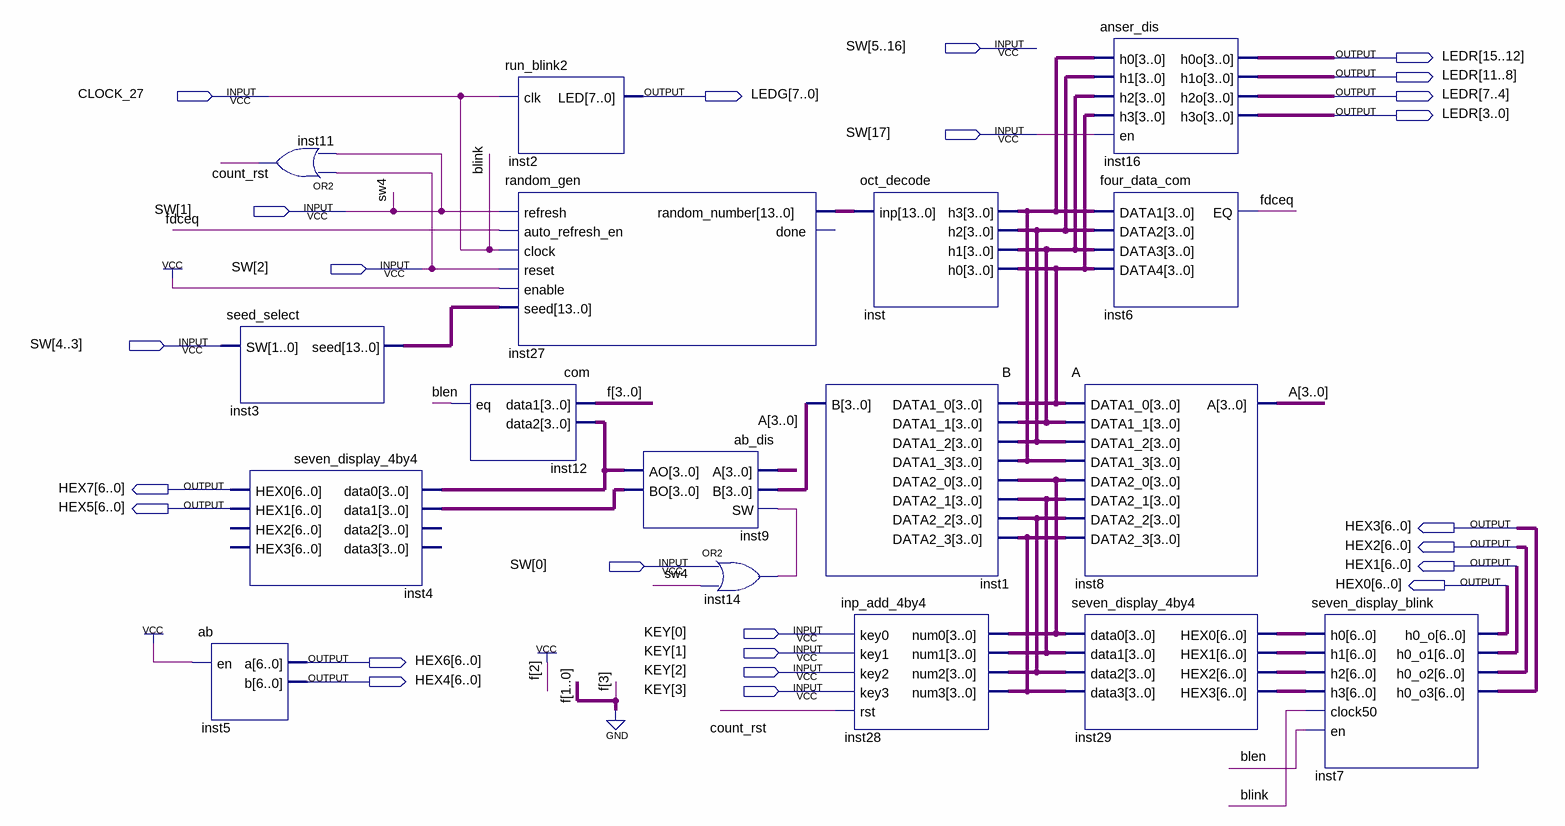
[diagram p0: schematic sheet]
// Quartus schematic FINAL.bdf as structural Verilog: 17 symbols, 24 pins
module FINAL (
  input  [0:17] SW,
  input  CLOCK_27,
  input  [3:0] KEY,
  output [15:0] LEDR,
  output [7:0] LEDG,
  output [6:0] HEX7,
  output [6:0] HEX5,
  output [6:0] HEX3,
  output [6:0] HEX2,
  output [6:0] HEX1,
  output [6:0] HEX0,
  output [6:0] HEX6,
  output [6:0] HEX4
);

  wire blen, count_rst, fdceq, inst14_out;
  wire [3:0] A, inst1_b, inst9_ao, inst9_bo, inst28_num0, inst28_num1, inst28_num2, inst28_num3, inst_h0,
       inst_h1, inst_h2, inst_h3;
  wire [3:3] f;
  wire [6:0] inst29_hex0, inst29_hex1, inst29_hex2, inst29_hex3;
  wire [13:0] inst3_seed, inst27_random_number;

  seed_select inst3 (.SW({SW[4], SW[3]}), .seed(inst3_seed));
  seven_display_4by4 inst4 (
    .data0(inst9_ao), .data1(inst9_bo), .HEX0(HEX7), .HEX1(HEX5));  // open: data2, data3, HEX2, HEX3
  ab inst5 (.en(1'b1), .a(HEX6), .b(HEX4));
  or inst11 (count_rst, SW[2], SW[1]);
  com inst12 (.data1({f[3], 3'b100}), .data2(inst9_ao), .eq(blen));
  run_blink2 inst2 (.clk(CLOCK_27), .LED(LEDG));
  random_gen inst27 (
    .refresh(SW[1]), .auto_refresh_en(fdceq), .clock(CLOCK_27), .reset(SW[2]), .enable(1'b1),
    .seed(inst3_seed), .random_number(inst27_random_number));  // open: done
  ab_dis inst9 (.A(A), .B(inst1_b), .SW(inst14_out), .AO(inst9_ao), .BO(inst9_bo));
  or inst14 (inst14_out, SW[0], SW[1]);
  oct_decode inst (.inp(inst27_random_number), .h3(inst_h3), .h2(inst_h2), .h1(inst_h1), .h0(inst_h0));
  B inst1 (
    .DATA1_0(inst_h0), .DATA1_1(inst_h1), .DATA1_2(inst_h2), .DATA1_3(inst_h3), .DATA2_0(inst28_num0),
    .DATA2_1(inst28_num1), .DATA2_2(inst28_num2), .DATA2_3(inst28_num3), .B(inst1_b));
  inp_add_4by4 inst28 (
    .key0(KEY[0]), .key1(KEY[1]), .key2(KEY[2]), .key3(KEY[3]), .rst(count_rst), .num0(inst28_num0),
    .num1(inst28_num1), .num2(inst28_num2), .num3(inst28_num3));
  A inst8 (
    .DATA1_0(inst_h0), .DATA1_1(inst_h1), .DATA1_2(inst_h2), .DATA1_3(inst_h3), .DATA2_0(inst28_num0),
    .DATA2_1(inst28_num1), .DATA2_2(inst28_num2), .DATA2_3(inst28_num3), .A(A));
  seven_display_4by4 inst29 (
    .data0(inst28_num0), .data1(inst28_num1), .data2(inst28_num2), .data3(inst28_num3), .HEX0(inst29_hex0),
    .HEX1(inst29_hex1), .HEX2(inst29_hex2), .HEX3(inst29_hex3));
  anser_dis inst16 (
    .h0(inst_h3), .h1(inst_h2), .h2(inst_h1), .h3(inst_h0), .en(SW[17]), .h0o(LEDR[15:12]), .h1o(LEDR[11:8]),
    .h2o(LEDR[7:4]), .h3o(LEDR[3:0]));
  four_data_com inst6 (.DATA1(inst_h3), .DATA2(inst_h2), .DATA3(inst_h1), .DATA4(inst_h0), .EQ(fdceq));
  seven_display_blink inst7 (
    .h0(inst29_hex0), .h1(inst29_hex1), .h2(inst29_hex2), .h3(inst29_hex3), .clock50(CLOCK_27), .en(blen),
    .h0_o(HEX0), .h0_o1(HEX1), .h0_o2(HEX2), .h0_o3(HEX3));

  // Other names for the same wires on the sheet: blink = CLOCK_27; sw4 = SW[1]
endmodule
